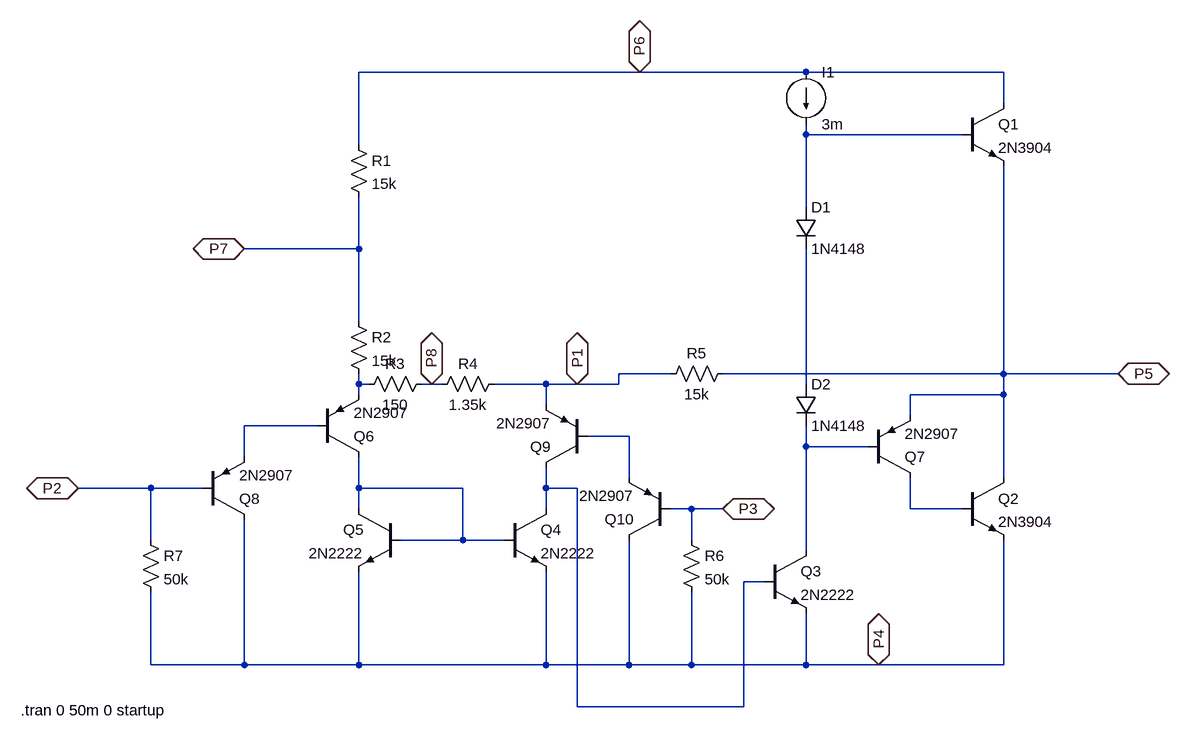
[diagram p0: schematic 3_27.asc]
3_27.asc, the LTspice schematic file:
Version 4
SHEET 1 5944 792
WIRE 592 -208 160 -208
WIRE 848 -208 592 -208
WIRE 1152 -208 848 -208
WIRE 1152 -160 1152 -208
WIRE 848 -112 848 -128
WIRE 1088 -112 848 -112
WIRE 160 -96 160 -208
WIRE 848 0 848 -112
WIRE 160 64 160 -16
WIRE 160 64 -16 64
WIRE 160 176 160 64
WIRE 640 256 560 256
WIRE 1152 256 1152 -64
WIRE 1152 256 720 256
WIRE 1328 256 1152 256
WIRE 160 272 160 256
WIRE 176 272 160 272
WIRE 272 272 256 272
WIRE 288 272 272 272
WIRE 448 272 368 272
WIRE 496 272 448 272
WIRE 560 272 560 256
WIRE 560 272 496 272
WIRE 848 272 848 64
WIRE 160 288 160 272
WIRE 1152 288 1152 256
WIRE 1152 288 1008 288
WIRE 448 304 448 272
WIRE 1008 320 1008 288
WIRE 96 336 -16 336
WIRE 576 352 512 352
WIRE 848 368 848 336
WIRE 944 368 848 368
WIRE -16 384 -16 336
WIRE 576 416 576 352
WIRE 1152 416 1152 288
WIRE -160 432 -272 432
WIRE -80 432 -160 432
WIRE 160 432 160 384
WIRE 320 432 160 432
WIRE 448 432 448 400
WIRE 496 432 448 432
WIRE 160 464 160 432
WIRE 448 464 448 432
WIRE 672 464 640 464
WIRE 720 464 672 464
WIRE 1008 464 1008 416
WIRE 1088 464 1008 464
WIRE -160 512 -160 432
WIRE 320 512 320 432
WIRE 320 512 224 512
WIRE 384 512 320 512
WIRE 672 512 672 464
WIRE 848 528 848 368
WIRE 784 576 752 576
WIRE -160 704 -160 592
WIRE -16 704 -16 480
WIRE -16 704 -160 704
WIRE 160 704 160 560
WIRE 160 704 -16 704
WIRE 448 704 448 560
WIRE 448 704 160 704
WIRE 576 704 576 512
WIRE 576 704 448 704
WIRE 672 704 672 592
WIRE 672 704 576 704
WIRE 848 704 848 624
WIRE 848 704 672 704
WIRE 960 704 848 704
WIRE 1152 704 1152 512
WIRE 1152 704 960 704
WIRE 496 768 496 432
WIRE 752 768 752 576
WIRE 752 768 496 768
FLAG -16 64 P7
IOPIN -16 64 BiDir
FLAG 496 272 P1
IOPIN 496 272 BiDir
FLAG 272 272 P8
IOPIN 272 272 BiDir
FLAG 592 -208 P6
IOPIN 592 -208 BiDir
FLAG 1328 256 P5
IOPIN 1328 256 BiDir
FLAG 960 704 P4
IOPIN 960 704 BiDir
FLAG -272 432 P2
IOPIN -272 432 BiDir
FLAG 720 464 P3
IOPIN 720 464 BiDir
SYMBOL res 144 -112 R0
SYMATTR InstName R1
SYMATTR Value 15k
SYMBOL res 144 160 R0
SYMATTR InstName R2
SYMATTR Value 15k
SYMBOL res 272 256 R90
WINDOW 0 0 56 VBottom 2
WINDOW 3 32 56 VTop 2
SYMATTR InstName R3
SYMATTR Value 150
SYMBOL res 384 256 R90
WINDOW 0 0 56 VBottom 2
WINDOW 3 32 56 VTop 2
SYMATTR InstName R4
SYMATTR Value 1.35k
SYMBOL res 736 240 R90
WINDOW 0 0 56 VBottom 2
WINDOW 3 32 56 VTop 2
SYMATTR InstName R5
SYMATTR Value 15k
SYMBOL diode 832 0 R0
SYMATTR InstName D1
SYMATTR Value 1N4148
SYMBOL diode 832 272 R0
SYMATTR InstName D2
SYMATTR Value 1N4148
SYMBOL current 848 -208 R0
WINDOW 123 0 0 Left 0
WINDOW 39 0 0 Left 0
SYMATTR InstName I1
SYMATTR Value 3m
SYMBOL npn 1088 -160 R0
SYMATTR InstName Q1
SYMATTR Value 2N3904
SYMBOL npn 1088 416 R0
SYMATTR InstName Q2
SYMATTR Value 2N3904
SYMBOL npn 784 528 R0
SYMATTR InstName Q3
SYMATTR Value 2N2222
SYMBOL npn 384 464 R0
SYMATTR InstName Q4
SYMATTR Value 2N2222
SYMBOL npn 224 464 M0
SYMATTR InstName Q5
SYMATTR Value 2N2222
SYMBOL pnp 96 384 M180
SYMATTR InstName Q6
SYMATTR Value 2N2907
SYMBOL pnp 944 416 M180
SYMATTR InstName Q7
SYMATTR Value 2N2907
SYMBOL pnp -80 480 M180
SYMATTR InstName Q8
SYMATTR Value 2N2907
SYMBOL pnp 512 400 R180
SYMATTR InstName Q9
SYMATTR Value 2N2907
SYMBOL pnp 640 512 R180
SYMATTR InstName Q10
SYMATTR Value 2N2907
SYMBOL res 656 496 R0
SYMATTR InstName R6
SYMATTR Value 50k
SYMBOL res -176 496 R0
SYMATTR InstName R7
SYMATTR Value 50k
TEXT -360 774 Left 2 !.tran 0 50m 0 startup

The netlist it stands for:
* 3_27.asc
R1 P6 P7 15k
R2 P7 N002 15k
R3 P8 N002 150
R4 P1 P8 1.35k
R5 P5 P1 15k
D1 N001 N003 1N4148
D2 N003 N006 1N4148
I1 P6 N001 3m
Q1 P6 N001 P5 0 2N3904
Q2 P5 N009 P4 0 2N3904
Q3 N006 N008 P4 0 2N2222
Q4 N008 N007 P4 0 2N2222
Q5 N007 N007 P4 0 2N2222
Q6 N007 N004 N002 0 2N2907
Q7 N009 N006 P5 0 2N2907
Q8 P4 P2 N004 0 2N2907
Q9 N008 N005 P1 0 2N2907
Q10 P4 P3 N005 0 2N2907
R6 P3 P4 50k
R7 P2 P4 50k
.model D D
.lib standard.dio
.model NPN NPN
.model PNP PNP
.lib standard.bjt
.tran 0 50m 0 startup
.backanno
.end